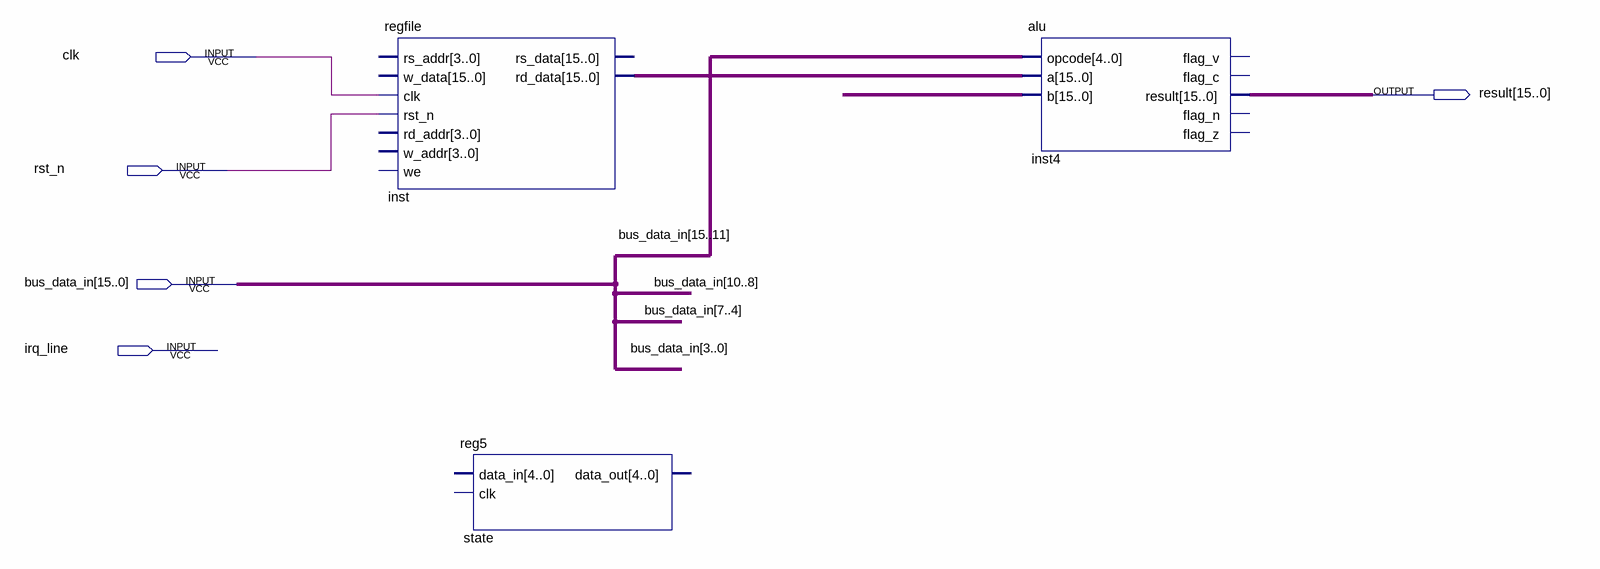
[diagram p0: schematic sheet]
// Quartus schematic cpu.bdf as structural Verilog: 3 symbols, 5 pins
module cpu (
  input  clk,
  input  rst_n,
  input  [15:0] bus_data_in,
  input  irq_line,
  output [15:0] result
);

  wire [15:0] inst_rd_data, undriven;

  regfile inst (
    .clk(clk), .rst_n(rst_n), .rd_data(inst_rd_data));  // open: rs_addr, w_data, rd_addr, w_addr, we, rs_data
  reg5 state ();  // open: data_in, clk, data_out
  alu inst4 (
    .opcode(bus_data_in[15:11]), .a(inst_rd_data), .b(undriven), .result(result));  // open: flag_v, flag_c, flag_n, flag_z
endmodule
